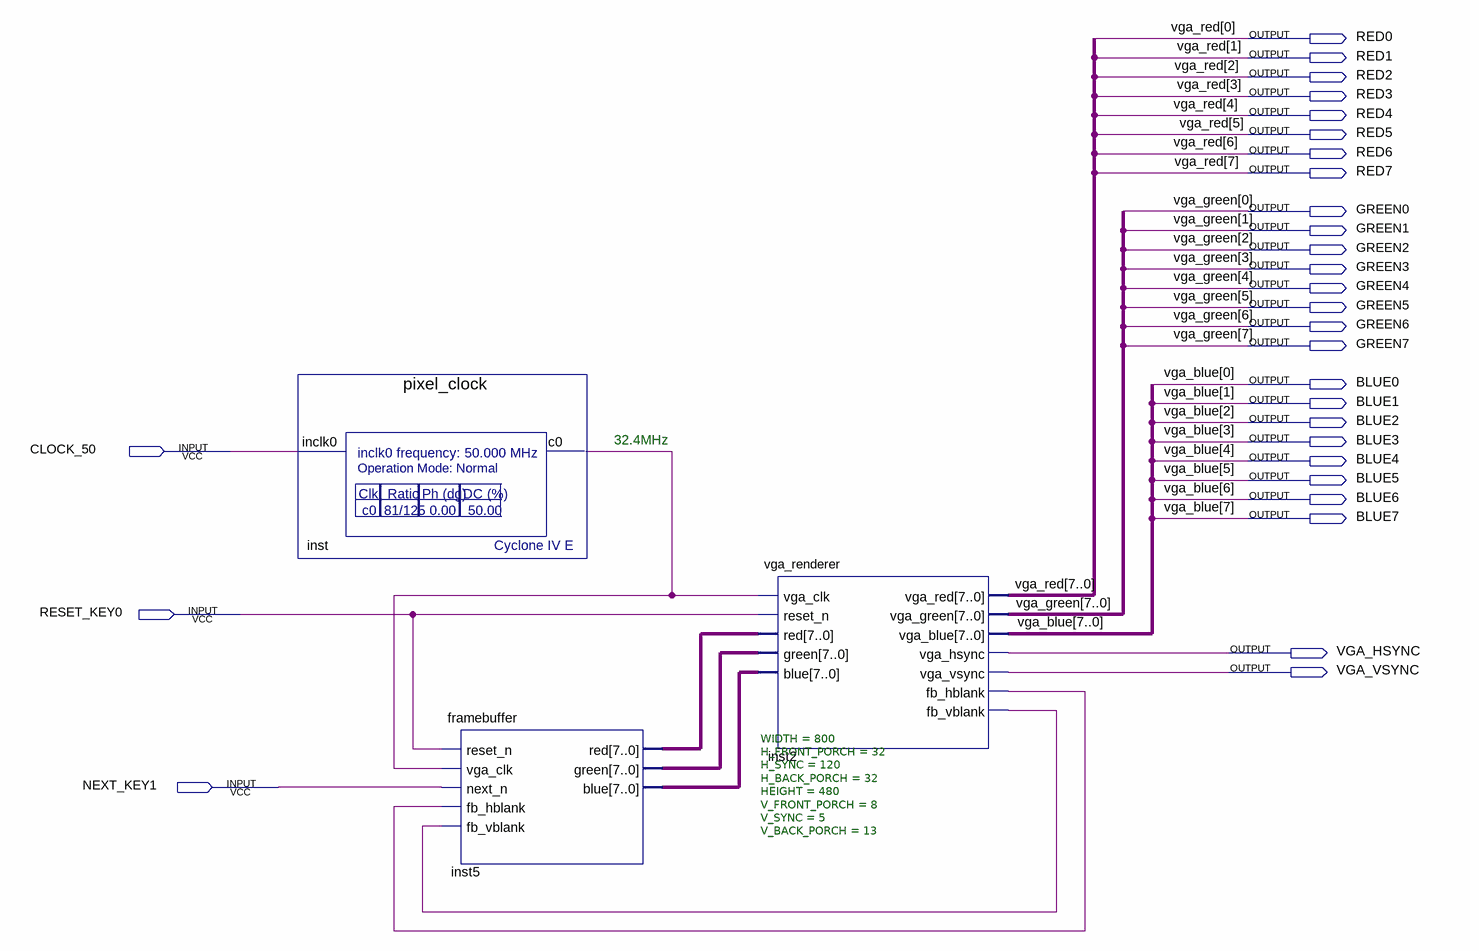
[diagram p0: schematic sheet]
// Quartus schematic vga_test.bdf as structural Verilog: 3 symbols, 29 pins
module vga_test (
  input  CLOCK_50,
  input  RESET_KEY0,
  input  NEXT_KEY1,
  output RED0,
  output RED1,
  output RED2,
  output RED3,
  output RED4,
  output RED5,
  output RED6,
  output RED7,
  output GREEN0,
  output GREEN1,
  output GREEN2,
  output GREEN3,
  output GREEN4,
  output GREEN5,
  output GREEN6,
  output GREEN7,
  output BLUE0,
  output BLUE1,
  output BLUE2,
  output BLUE3,
  output BLUE4,
  output BLUE5,
  output BLUE6,
  output BLUE7,
  output VGA_HSYNC,
  output VGA_VSYNC
);

  wire inst2_fb_hblank, inst2_fb_vblank, inst_c0;
  wire [7:0] inst5_blue, inst5_green, inst5_red;

  pixel_clock inst (.inclk0(CLOCK_50), .c0(inst_c0));
  framebuffer inst5 (
    .reset_n(RESET_KEY0), .vga_clk(inst_c0), .next_n(NEXT_KEY1), .fb_hblank(inst2_fb_hblank),
    .fb_vblank(inst2_fb_vblank), .red(inst5_red), .green(inst5_green), .blue(inst5_blue));
  vga_renderer #(.WIDTH(800), .H_FRONT_PORCH(32), .H_SYNC(120), .H_BACK_PORCH(32), .HEIGHT(480), .V_FRONT_PORCH(8), .V_SYNC(5), .V_BACK_PORCH(13)) inst2 (
    .vga_clk(inst_c0), .reset_n(RESET_KEY0), .red(inst5_red), .green(inst5_green), .blue(inst5_blue),
    .vga_red({RED7, RED6, RED5, RED4, RED3, RED2, RED1, RED0}),
    .vga_green({GREEN7, GREEN6, GREEN5, GREEN4, GREEN3, GREEN2, GREEN1, GREEN0}),
    .vga_blue({BLUE7, BLUE6, BLUE5, BLUE4, BLUE3, BLUE2, BLUE1, BLUE0}), .vga_hsync(VGA_HSYNC),
    .vga_vsync(VGA_VSYNC), .fb_hblank(inst2_fb_hblank), .fb_vblank(inst2_fb_vblank));

  // Other names for the same wires on the sheet: vga_blue[7:0] = {BLUE7, BLUE6, BLUE5, BLUE4, BLUE3, BLUE2, BLUE1, BLUE0};
  //   vga_green[7:0] = {GREEN7, GREEN6, GREEN5, GREEN4, GREEN3, GREEN2, GREEN1, GREEN0};
  //   vga_red[7:0] = {RED7, RED6, RED5, RED4, RED3, RED2, RED1, RED0}

  // Notes on the sheet:
  //   32.4MHz
endmodule
